# EAGLE design TeraDMX_v1_2 (EAGLE 6.3)
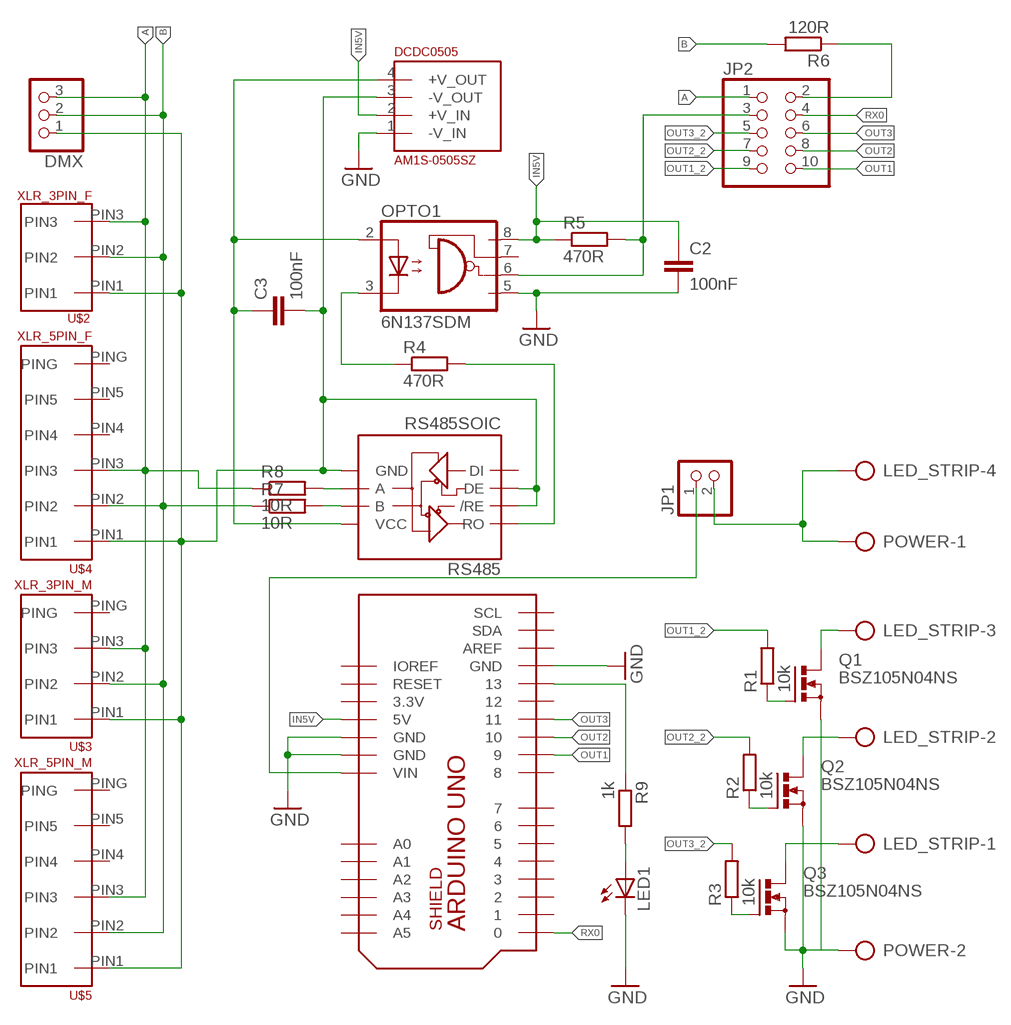
[diagram p0: schematic, sheet 1]

## Parts
C2  100nF  C-EUC0805  [C0805]
C3  100nF  C-EUC0805  [C0805]
DCDC0505  AM1S-0505SZ  [AM1S-0505SZ]
DMX  PINHD-1X3  [1X03]
JP1  PINHD-1X2  [1X02]
JP2  PINHD-2X5  [2X05]
LED1  LEDCHIP-LED0805  [CHIP-LED0805]
LED_STRIP  AK300/4  [AK300/4]
OPTO1  6N137SDM  [6N137SDM]
POWER  AK300/2  [AK300/2]
Q1  BSZ105N04NS  [PG-TDSON-8]
Q2  BSZ105N04NS  [PG-TDSON-8]
Q3  BSZ105N04NS  [PG-TDSON-8]
R1  10k  R-EU_M0805  [M0805]
R2  10k  R-EU_M0805  [M0805]
R3  10k  R-EU_M0805  [M0805]
R4  470R  R-EU_M0805  [M0805]
R5  470R  R-EU_R0805  [R0805]
R6  120R  R-EU_M0805  [M0805]
R7  10R  R-EU_M0805  [M0805]
R8  10R  R-EU_M0805  [M0805]
R9  1k  R-EU_M0805  [M0805]
RS485  RS485SOIC  [SO08]
U$2  XLR_3PIN_F  [XLR_3PIN_F]
U$3  XLR_3PIN_M  [XLR_3PIN_M]
U$4  XLR_5PIN_F  [XLR_5PIN_F]
U$5  XLR_5PIN_M  [XLR_5PIN_M]
U$6  ARDUINO_UNO_SHIELD  [ARDUINO_UNO_SHIELD]

## Nets
A: DMX.3 JP2.1 R8.1 U$2.PIN3 U$3.PIN3 U$4.PIN3 U$5.PIN3
B: DMX.2 R6.2 R7.1 U$2.PIN2 U$3.PIN2 U$4.PIN2 U$5.PIN2
GND: C2.2 DCDC0505.1(-V_IN) LED1.C OPTO1.5(GND) POWER.2 Q1.1(S) Q1.2(S) Q1.3(S) Q2.1(S) Q2.2(S) Q2.3(S) Q3.1(S) Q3.2(S) Q3.3(S) U$6.GND1(GND) U$6.GND2(GND) U$6.GND3(GND)
IN5V: C2.1 DCDC0505.2(+V_IN) OPTO1.8(VCC) R5.1 U$6.5V
N$1: C3.2 DCDC0505.3(-V_OUT) DMX.1 RS485.2(/RE) RS485.3(DE) RS485.5(GND) U$2.PIN1 U$3.PIN1 U$4.PIN1 U$5.PIN1
N$2: C3.1 DCDC0505.4(+V_OUT) OPTO1.2(A) RS485.8(VCC)
N$3: OPTO1.3(C) R4.1
N$5: LED_STRIP.1 Q3.5(D) Q3.6(D) Q3.7(D) Q3.8(D) Q3.TH(D)
N$6: LED_STRIP.2 Q2.5(D) Q2.6(D) Q2.7(D) Q2.8(D) Q2.TH(D)
N$7: LED_STRIP.3 Q1.5(D) Q1.6(D) Q1.7(D) Q1.8(D) Q1.TH(D)
N$8: JP2.2 R6.1
N$9: Q1.4(G) R1.1
N$10: Q2.4(G) R2.1
N$11: Q3.4(G) R3.1
N$12: R4.2 RS485.1(RO)
N$13: JP2.3 OPTO1.6(VO) R5.2
N$16: R7.2 RS485.7(B)
N$17: R8.2 RS485.6(A)
N$22: JP1.1 U$6.VIN
N$24: R9.1 U$6.13
N$25: LED1.A R9.2
OUT1: JP2.10 U$6.9
OUT1_2: JP2.9 R1.2
OUT2: JP2.8 U$6.10
OUT2_2: JP2.7 R2.2
OUT3: JP2.6 U$6.11
OUT3_2: JP2.5 R3.2
PLUS: JP1.2 LED_STRIP.4 POWER.1
RX0: JP2.4 U$6.0
Unconnected: OPTO1.7(VE) RS485.4(DI) U$3.PING U$4.PIN4 U$4.PIN5 U$4.PING U$5.PIN4 U$5.PIN5 U$5.PING U$6.1 U$6.2 U$6.3 U$6.4 U$6.5 U$6.6 U$6.7 U$6.8 U$6.12 U$6.A0 U$6.A1 U$6.A2 U$6.A3 U$6.A4 U$6.A5 U$6.AREF U$6.IOREF U$6.RESET U$6.SCL U$6.SDA

## Power pins joined to a net without a drawn wire
3.3V: U$6.3.3V

## Library data of the parts
C2 C3 = rcl:C-EU: CAPACITOR, European symbol
DCDC0505 = 0_MojaBiblioteka:AM1S-0505SZ
DMX = pinhead:PINHD-1X3: PIN HEADER
JP1 = pinhead:PINHD-1X2: PIN HEADER
JP2 = pinhead:PINHD-2X5: PIN HEADER
LED1 = led:LED: LED OSRAM: - CHIPLED LG R971, LG N971, LY N971, LG Q971, LY Q971, LO R971, LY R971 LH N974, LH R974 LS Q976, LO Q976, LY Q976 LO Q996 - Hyper CHIPLED LW Q18S LB Q993, LB Q99A, LB R99A - SideLED LS A670, LO A670, LY A670, LG A670, LP A670 LB A673, LV A673, LT A673, LW A673 LH A674 LY A675 LS A676, LA A676, LO A676, LY A676, LW A676 LS A679, LY A679, LG A679 - Hyper Micro SIDELED® LS Y876, LA Y876, LO Y876, LY Y876 LT Y87S - SmartLED LW L88C, LW L88S LB L89C, LB L89S, LG L890 LS L89K, LO L89K, LY L89K LS L896, LA L896, LO L896, LY L896 - TOPLED LS T670, LO T670, LY T670, LG T670, LP T670 LSG T670, LSP T670, LSY T670, LOP T670, LYG T670 LG T671, LOG T671, LSG T671 LB T673, LV T673, LT T673, LW T673 LH T674 LS T676, LA T676, LO T676, LY T676, LB T676, LH T676, LSB T676, LW T676 LB T67C, LV T67C, LT T67C, LS T67K, LO T67K, LY T67K, LW E67C LS E67B, LA E67B, LO E67B, LY E67B, LB E67C, LV E67C, LT E67C LW T67C LS T679, LY T679, LG T679 LS T770, LO T770, LY T770, LG T770, LP T770 LB T773, LV T773, LT T773, LW T773 LH T774 LS E675, LA E675, LY E675, LS T675 LS T776, LA T776, LO T776, LY T776, LB T776 LHGB T686 LT T68C, LB T68C - Hyper Mini TOPLED® LB M676 - Mini TOPLED Santana® LG M470 LS M47K, LO M47K, LY M47K Source: http://www.osram.convergy.de LUXEON: - LUMILED® LXK2-PW12-R00, LXK2-PW12-S00, LXK2-PW14-U00, LXK2-PW14-V00 LXK2-PM12-R00, LXK2-PM12-S00, LXK2-PM14-U00 LXK2-PE12-Q00, LXK2-PE12-R00, LXK2-PE12-S00, LXK2-PE14-T00, LXK2-PE14-U00 LXK2-PB12-K00, LXK2-PB12-L00, LXK2-PB12-M00, LXK2-PB14-N00, LXK2-PB14-P00, LXK2-PB14-Q00 LXK2-PR12-L00, LXK2-PR12-M00, LXK2-PR14-Q00, LXK2-PR14-R00 LXK2-PD12-Q00, LXK2-PD12-R00, LXK2-PD12-S00 LXK2-PH12-R00, LXK2-PH12-S00 LXK2-PL12-P00, LXK2-PL12-Q00, LXK2-PL12-R00 Source: www.luxeon.com KINGBRIGHT: KA-3528ASYC Source: www.kingbright.com
LED_STRIP = con-ptr500:AK300/4: CONNECTOR; OC_FARNELL: unknown; OC_NEWARK: unknown
OPTO1 = 0_MojaBiblioteka:6N137SDM: http://www.tme.eu/pl/Document/9e34bdb0dbfb6811f7da938330bd3ec8/6N137M.pdf
POWER = con-ptr500:AK300/2: CONNECTOR; OC_FARNELL: unknown; OC_NEWARK: unknown
Q1-Q3 = 0_MojaBiblioteka:BSZ105N04NS: OptiMOS (TM)3 Power-Transistor N-Channel, Normal level Source : Data sheet <http://www.infineon.com/dgdl/BSZ105N04NSG_rev1.1.pdf?folderId=db3a3043156fd5730115c7d50620107c&fileId=db3a30431689f4420116c485c67f084e>
R1-R9 = rcl:R-EU_: RESISTOR, European symbol
RS485 = SparkFun-DigitalIC:RS485: RS485 transceiver
U$2 = 0_MojaBiblioteka:XLR_3PIN_F: AMPHENOL AC3FAH-AU-PRE Gniazdo; XLR; żeńskie; PIN:3; kątowe 90°; z przyciskiem; THT; 133V http://www.tme.eu/pl/details/ac3fah-au-pre/zlacza-xlr/amphenol/ http://www.tme.eu/pl/Document/09a1d31ba2723210cedbb5dd43d3df77/AC3FAH-AU-PRE.pdf
U$3 = 0_MojaBiblioteka:XLR_3PIN_M: AMPHENOL AC3MAH-AU-PRE Gniazdo; XLR; męskie; PIN:3; kątowe 90°; przykręcane; THT; złocony http://www.tme.eu/pl/details/ac3mah-au-pre/zlacza-xlr/amphenol/ http://www.tme.eu/pl/Document/d88f4fba44421ffb781d4352edeebc64/AC3MAH-AU-PRE.pdf
U$4 = 0_MojaBiblioteka:XLR_5PIN_F: CLIFF 5XNACF/PC90L (CP300405) Gniazdo; XLR; żeńskie; PIN:5; kątowe 90°; z przyciskiem; THT; 5A http://www.tme.eu/pl/details/cp300405/zlacza-xlr/cliff/5xnacfpc90l-cp300405/
U$5 = 0_MojaBiblioteka:XLR_5PIN_M: CLIFF 5XNACM/PC90(CP300255) Gniazdo; XLR; męskie; PIN:5; kątowe 90°; na panel, przykręcane; THT http://www.tme.eu/pl/details/cp300255/zlacza-xlr/cliff/5xnacmpc90cp300255/
U$6 = 0_Xirux:ARDUINO_UNO_SHIELD: Arduino Uno Shield by Robert Mordzon

## Board
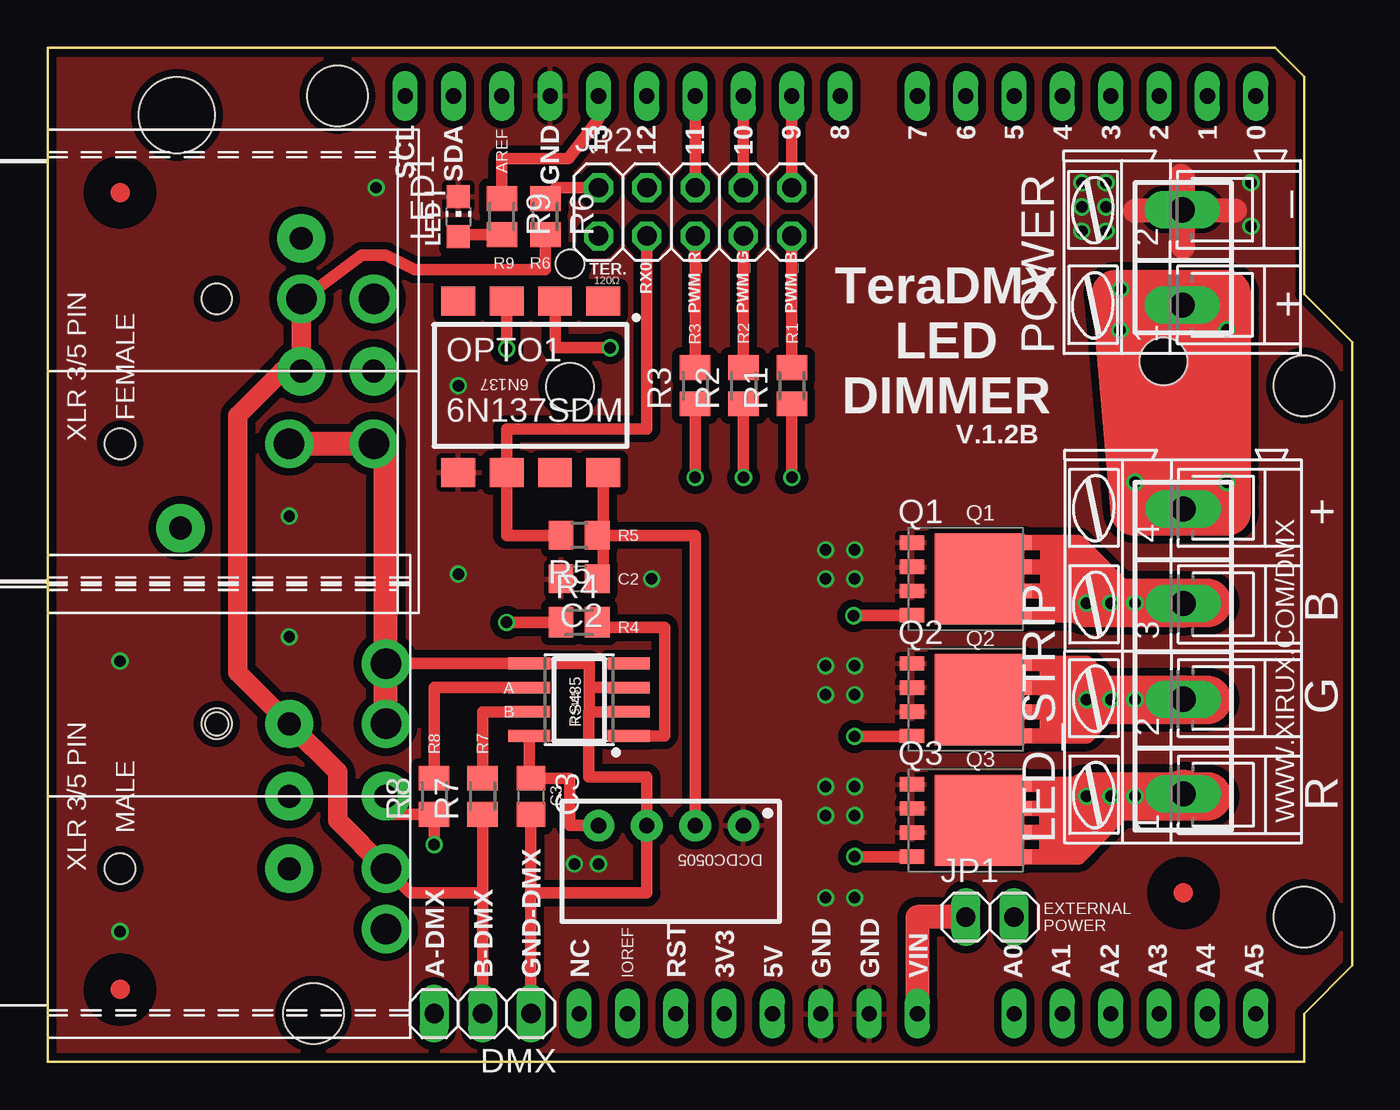
[diagram p1: board, top side]
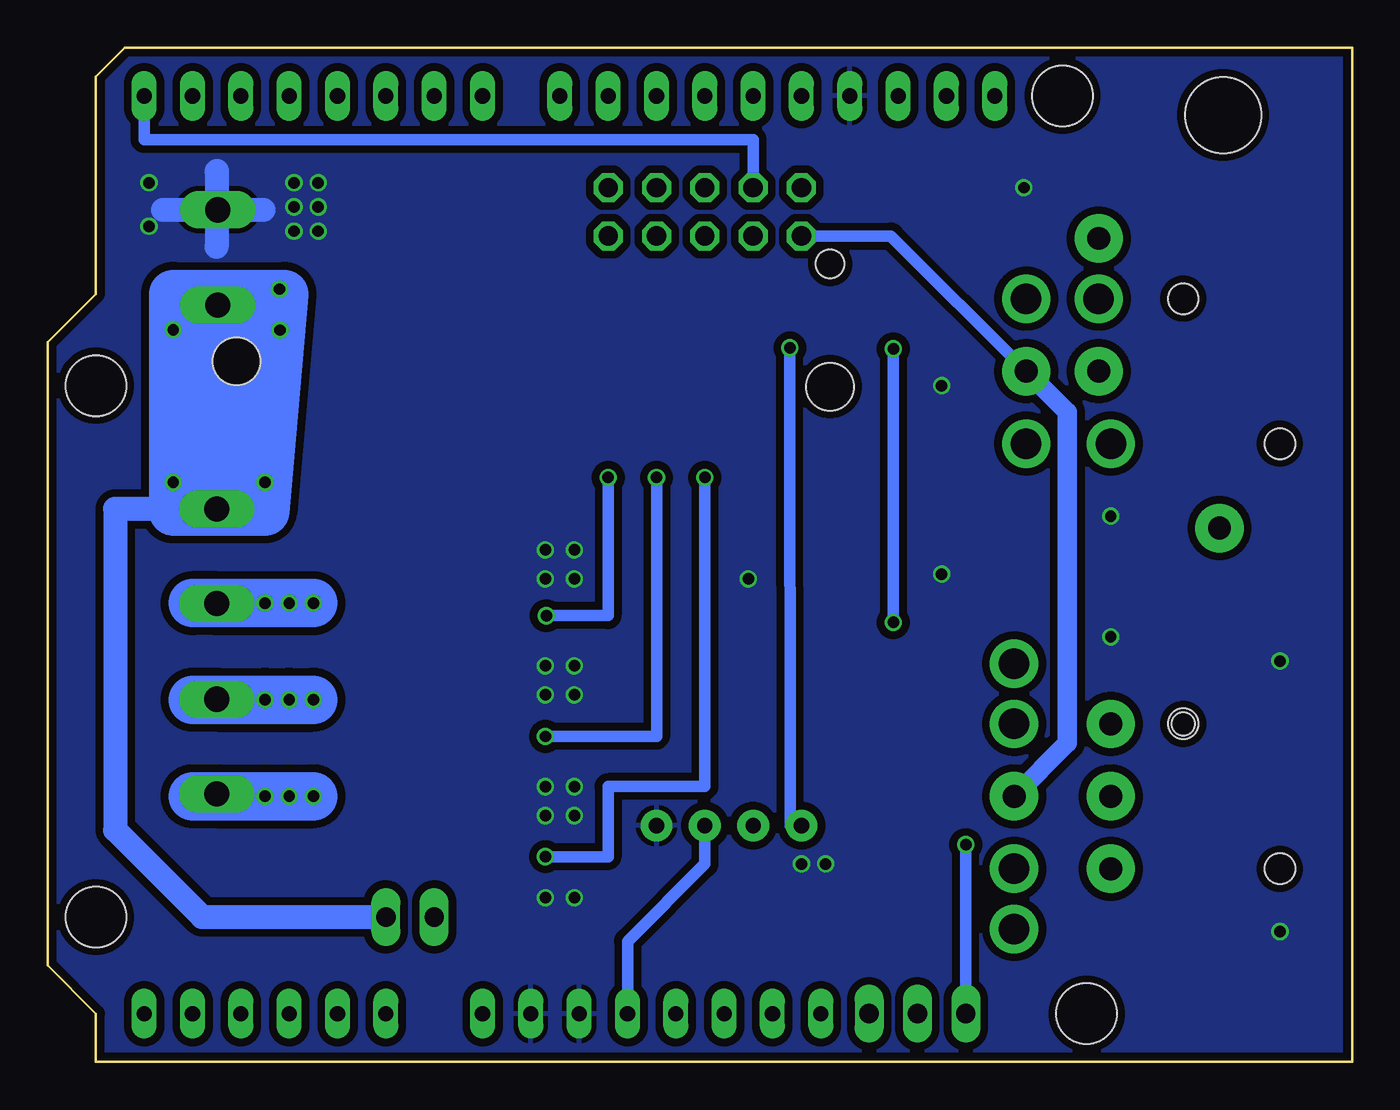
[diagram p2: board, bottom side, seen from below]

Size 68.58 x 53.34 mm. Coordinates in mm from the lower left corner, seen from the top.
Copper layers (1*16): Top 0.035mm / dielectric 1.5mm / Bottom 0.035mm
Design rules "SeeedStudio_2layer_DRU_no_angle_20140221 *": minimum track width 6mil, minimum drill 12mil, track to track 6mil, track to pad 6mil, pad to pad 6mil, via to via 6mil, smd to smd 0mil, copper to edge 10mil, drill to drill 10mil, minimum pad ring 10mil, minimum via ring 6mil, stop-mask expansion 2mil, vias tented up to drill 100mil, thermal gap 10mil
Holes 2.5 mm at 58.65,36.83 27.46,35.51
Holes 1.5 mm at 27.46,41.96
Holes 4 mm at 6.8,49.79

### Footprints (pad centres in the part's own frame; a part is rotated, then mirrored left to right if it is on the bottom)
C0805 = smd 1.3 x 1.5: 1 -0.95,0; 2 0.95,0
AM1S-0505SZ = drill 0.8 pad 1.676: 1 -3.81,-2.54; 2 -1.27,-2.54; 3 1.27,-2.54; 4 3.81,-2.54
1X03 = drill 1.016 long: 1 -2.54,0; 2 0,0; 3 2.54,0
1X02 = drill 1.016 long: 1 -1.27,0; 2 1.27,0
2X05 = drill 1.016 octagon: 1 -5.08,-1.27; 2 -5.08,1.27; 3 -2.54,-1.27; 4 -2.54,1.27; 5 0,-1.27; 6 0,1.27; 7 2.54,-1.27; 8 2.54,1.27; 9 5.08,-1.27; 10 5.08,1.27
CHIP-LED0805 = smd 1.2 x 1.2: A 0,-1.05; C 0,1.05
AK300/4 = drill 1.321 long: 1 -7.493,0; 2 -2.515,0; 3 2.515,0; 4 7.493,0
6N137SDM = smd 1.778 x 1.524: 1 3.81,4.445; 2 1.27,4.445; 3 -1.27,4.445; 4 -3.81,4.445; 5 -3.81,-4.572; 6 -1.27,-4.572; 7 1.27,-4.572; 8 3.81,-4.572
AK300/2 = drill 1.321 long: 1 -2.515,0; 2 2.489,0
PG-TDSON-8 = smd 1.3 x 0.75: 1 -2.825,1.905; 2 -2.825,0.635; 3 -2.825,-0.635; 4 -2.825,-1.905; 5 2.825,-1.905; 6 2.825,-0.635; 7 2.825,0.635; 8 2.825,1.905 | smd 4.7 x 4.8: TH 0.725,0
M0805 = smd 1.3 x 1.6: 1 -0.95,0; 2 0.95,0
R0805 = smd 1.3 x 1.5: 1 -0.95,0; 2 0.95,0
SO08 = smd 0.61 x 2.21: 1 -1.905,-2.616; 2 -0.635,-2.616; 3 0.635,-2.616; 4 1.905,-2.616; 5 1.905,2.616; 6 0.635,2.616; 7 -0.635,2.616; 8 -1.905,2.616
XLR_3PIN_F = drill 1.6 pad 2.54: PIN1 -3.81,-12.7; PIN2 3.81,-13.335 | drill 1.2 pad 2.54: PIN3 0,-17.145 | hole 1.6: -3.81,-3.81; 3.81,-8.89
XLR_3PIN_M = drill 1.6 pad 2.54: PIN1 3.81,-17.78; PIN2 -3.81,-17.78 | drill 1.2 pad 2.54: PIN3 0,-17.78; PING 0,-12.7 | hole 1.6: 3.81,-8.89; -3.81,-3.81
XLR_5PIN_F = drill 1.6 pad 2.54: PIN1 -3.81,-17.145; PIN5 3.81,-17.145 | drill 1.2 pad 2.54: PIN2 0,-13.335; PIN3 0,-17.145; PIN4 6.985,-13.335; PING -8.25,-6.985 | hole 1.6: 3.81,-8.89; -3.81,-3.81
XLR_5PIN_M = drill 1.6 pad 2.54: PIN1 6.98,-17.78; PIN5 -6.98,-17.78 | drill 1.2 pad 2.54: PIN2 3.81,-12.7; PIN3 0,-17.78; PIN4 -3.81,-12.7; PING 0,-12.7 | hole 1.6: -3.81,-3.81 | hole 1.2: 3.81,-8.89
ARDUINO_UNO_SHIELD = drill 0.8 long: 0 63.5,50.8; 1 60.96,50.8; 2 58.42,50.8; 3 55.88,50.8; 3.3V 35.56,2.54; 4 53.34,50.8; 5 50.8,50.8; 5V 38.1,2.54; 6 48.26,50.8; 7 45.72,50.8; 8 41.656,50.8; 9 39.116,50.8; 10 36.576,50.8; 11 34.036,50.8; 12 31.496,50.8; 13 28.956,50.8; A0 50.8,2.54; A1 53.34,2.54; A2 55.88,2.54; A3 58.42,2.54; A4 60.96,2.54; A5 63.5,2.54; AREF 23.876,50.8; GND1 26.416,50.8; GND2 40.64,2.54; GND3 43.18,2.54; IOREF 30.48,2.54; NC 27.94,2.54; RESET 33.02,2.54; SCL 18.796,50.8; SDA 21.336,50.8; VIN 45.72,2.54 | hole 3.175: 15.24,50.8; 13.97,2.54; 66.04,35.56; 66.04,7.62

### Placement (x,y rotation side)
C2  27.94,25.4 180 top
C3  25.4,13.97 270 top
DCDC0505  32.77,9.89 180 top
DMX  22.86,2.54 180 top
JP1  49.53,7.62 0 top
JP2  34.04,44.7 0 top
LED1  21.59,44.45 0 top
LED_STRIP  59.69,21.59 90 top
OPTO1  25.4,35.56 0 top
POWER  59.64,42.32 90 top
Q1  48.26,25.4 0 top
Q2  48.26,19.05 0 top
Q3  48.26,12.7 0 top
R1  39.12,35.56 90 top
R2  36.58,35.56 90 top
R3  34.04,35.56 90 top
R4  27.94,23.11 0 top
R5  27.94,27.69 180 top
R6  26.16,44.45 270 top
R7  22.86,13.97 90 top
R8  20.32,13.97 90 top
R9  23.88,44.45 270 top
RS485  27.94,19.05 90 top
U$1  [CIRCLE-1MM-3R]  3.81,3.81 0 top
U$2  0,36.32 90 top
U$3  0,13.97 90 top
U$4  0,36.32 90 top
U$5  0,13.97 90 top
U$6  0,0 0 top
U$7  [CIRCLE-1MM-3R]  3.81,45.72 0 top
U$8  [CIRCLE-1MM-3R]  59.69,8.89 0 top

### Tracks (layer width: path | path; a pad name or v marks a point on that pad's centre or on a via)
A  (via drill 0.6)
  Top 0.61: U$3.PIN3 17.78,13.02 R8.1 v20.32,11.43
  Bottom 0.61: JP2.1 24.26,43.43 U$2.PIN3 | DMX.3 v20.32,11.43
  Bottom 1.016: U$2.PIN3 14.99,34.16 14.99,16.76 U$3.PIN3
B
  Top 0.61: U$3.PIN2 19.05,8.89 22.86,8.89 | 22.86,8.89 R7.1 | DMX.2 22.86,8.89 | U$2.PIN2 13.46,40.13 16.51,42.42 17.78,42.42 19.3,41.66 26.16,41.66 R6.2
  Top 1.016: U$2.PIN2 U$4.PIN2 12.32,36.32 10,34 10,20.48 U$5.PIN2 15.24,15.24 15.24,12.7 U$3.PIN2
GND  (via drill 0.6)
  Top 1.27: 62.41,44.78 62.31,44.76 57.15,44.76 | 59.56,46.58 59.66,46.51 59.66,42.85
  Bottom 1.27: 62.51,44.81 57.23,44.81 | 59.66,46.86 59.69,46.84 59.69,42.85
  other vias: 27.69,10.41 42.42,26.92 42.42,25.4 40.89,26.92 42.42,20.83 42.42,19.3 40.89,19.3 40.89,20.83 40.89,25.4 42.42,14.48 42.42,12.95 40.89,12.95 40.89,14.48 28.96,10.41 31.75,25.4 21.59,25.65 17.27,45.97 21.59,35.56 54.36,46.23 54.36,44.96 55.63,44.96 55.63,46.23 63.25,46.23 63.25,43.94 3.81,6.86 3.81,21.08 54.36,43.69 55.63,43.69 40.89,8.64 42.42,8.64 12.7,28.7 12.7,22.35
  pour Top (isolate 0.406): 0,53.34 0,0 66.04,0 66.04,2.54 68.58,5.08 68.58,37.85 66.04,40.39 66.04,51.82 64.52,53.34
  pour Bottom (isolate 0.406): 0,53.34 0,0 66.04,0 66.04,2.54 68.58,5.08 68.58,37.85 66.04,40.39 66.04,51.82 64.52,53.34
IN5V
  Top 0.61: DCDC0505.2 34.04,27.69 R5.1 29.21,27.69 | OPTO1.8 29.21,27.69 | C2.1 29.21,25.4 29.21,27.69
  Bottom 0.61: DCDC0505.2 34.04,10.41 38.1,6.35 U$6.5V
N$1
  Top 0.61: 28.46,18.41 RS485.2 | 28.46,18.41 28.46,19.68 | 28.46,19.68 RS485.3 | 28.46,19.68 28.46,20.95 RS485.5 U$5.PIN1 | DMX.1 25.4,8.89 | 25.4,8.89 31.5,8.89 DCDC0505.3 31.5,14.99 28.45,14.99 28.45,18.41 28.46,18.41 | C3.2 25.4,8.89
  Top 1.27: U$2.PIN1 U$4.PIN1 17.78,32.51 U$5.PIN1 U$3.PIN1
N$2  (via drill 0.6)
  Top 0.61: RS485.8 25.32,14.92 C3.1 27.43,14.92 27.43,12.43 DCDC0505.4 | v29.57,37.55 26.67,37.55 OPTO1.2
  Bottom 0.61: DCDC0505.4 29.54,12.42 v29.57,37.55
N$3  (via drill 0.6)
  Top 0.61: OPTO1.3 v24.13,37.5 | v24.13,23.11 R4.1
  Bottom 0.61: v24.13,37.5 v24.13,23.11
N$4  (via drill 0.6)
  Top 2.54: 58.42,39.37 57.15,39.37 v56.36,38.48 v57.15,30.48 57.15,28.96 | 61.98,39.37 v61.98,38.51 v61.98,30.48 61.98,28.96 57.15,28.96 | 61.98,39.37 60.96,39.37 | 59.69,39.37 58.42,39.37 | 58.42,39.37 58.42,29.21 59.69,29.21 | 59.69,29.21 60.96,29.21 60.96,39.37 | 60.96,39.37 59.69,39.37 | 59.69,39.37 59.69,29.21 | 61.98,39.37 61.98,40.39 56.13,40.39 57.15,28.96
  Bottom 2.54: 57.15,28.96 v57.15,30.48 v56.36,38.48 57.15,39.37 60.96,39.37 | v61.98,30.48 61.98,28.96 57.15,28.96 | v61.98,30.48 v61.98,38.51 61.72,36.58 60.96,39.37 | 60.96,39.37 60.96,30.48 59.69,30.48 | 59.69,30.48 58.42,30.48 58.42,38.1 59.69,38.1 59.69,30.48 | v61.98,30.48 61.98,40.39 56.13,40.39 57.15,28.96
N$5  (via drill 0.6)
  Top 0.813: Q3.5 54.2,10.79 57.3,13.97 | Q3.6 53.98,12.06 v55.88,13.97 55.24,14.61 Q3.8 | v54.61,13.97 53.98,13.34 Q3.7 49.62,13.34 Q3.TH
  Top 2.54: LED_STRIP.1 59.69,13.97 | 59.69,13.97 57.3,13.97 v57.15,13.97 v55.88,13.97 v54.61,13.97 | 59.69,13.97 60.96,13.97
  Bottom 2.54: v54.61,13.97 v55.88,13.97 v57.15,13.97 59.69,13.97 60.96,13.97
N$6  (via drill 0.6)
  Top 0.813: 54.61,19.68 Q2.7 48.98,19.68 Q2.TH | 54.61,19.68 v54.61,19.05 54.61,18.41 | Q2.6 54.61,18.41 | Q2.5 54.61,17.14 | 54.61,17.14 54.61,18.41 | Q2.8 54.61,20.95 | 54.61,20.95 54.61,19.68 | 53.34,17.78 53.98,17.78 54.61,17.14 | 54.61,17.14 55.63,18.16 | 53.34,20.32 53.98,20.32 54.61,20.95 | 54.61,20.95 55.65,19.91
  Top 2.54: LED_STRIP.2 59.69,19.05 | 59.69,19.05 v57.15,19.05 v55.88,19.05 v54.61,19.05 | 59.69,19.05 60.96,19.05
  Bottom 2.54: v54.61,19.05 v55.88,19.05 v57.15,19.05 59.69,19.05 60.96,19.05
N$7  (via drill 0.6)
  Top 0.813: Q1.5 53.98,23.5 54.18,23.7 | 54.18,23.7 v54.61,24.13 53.98,24.77 Q1.6 | 54.18,26.04 Q1.7 48.98,26.04 Q1.TH | 54.18,26.04 54.18,23.7 | Q1.8 53.34,27.3 | 54.18,27.3 54.18,26.04 | 53.34,26.67 53.34,27.3 | 53.34,27.3 54.18,27.3 | 54.18,27.3 56.64,24.84 55.93,24.84 54.28,26.49 54.28,26.09 54.03,25.83 54.3,25.83 54.86,25.27
  Top 2.54: LED_STRIP.3 59.69,24.13 | 59.69,24.13 v57.15,24.13 v55.88,24.13 v54.61,24.13 | 59.69,24.13 60.96,24.13
  Bottom 2.54: v54.61,24.13 v55.88,24.13 v57.15,24.13 59.69,24.13 60.96,24.13
N$8
  Top 0.61: JP2.2 26.74,45.97 R6.1
N$9  (via drill 0.6)
  Top 0.61: v39.12,30.73 R1.1 | v42.37,23.47 45.38,23.47 Q1.4
  Bottom 0.61: v39.12,30.73 39.12,23.47 v42.37,23.47
N$10  (via drill 0.6)
  Top 0.61: R2.1 v36.58,30.73 | v42.42,17.12 45.44,17.12 Q2.4
  Bottom 0.61: v36.58,30.73 36.58,17.12 v42.42,17.12
N$11  (via drill 0.6)
  Top 0.61: R3.1 v34.04,30.73 | v42.42,10.79 Q3.4
  Bottom 0.61: v34.04,30.73 34.04,14.48 39.12,14.48 39.12,10.79 v42.42,10.79
N$12
  Top 0.61: R4.2 29.65,22.86 32.44,22.86 32.44,17.14 RS485.1
N$13
  Top 0.61: R5.2 24.13,27.69 OPTO1.6 24.13,33.29 31.5,33.29 JP2.3
N$14  (via drill 0.6)
  other vias: 56.39,40.64
N$15
  Top 0.813: 52.58,27.08 52.58,24.08 54.08,24.08 54.08,26.64 52.88,26.64 52.88,25.48 52.93,25.48 52.93,25.5 53.54,25.5
N$16
  Top 0.61: R7.2 22.86,18.41 RS485.7
N$17
  Top 0.61: RS485.6 20.32,19.68 R8.2
N$18
  Top 0.813: 54.13,20.57 54.13,17.7 52.55,17.7 | 52.55,17.7 52.55,20.68 | 52.55,17.7 52.55,17.17 53.06,17.17 53.06,20.47 53.65,20.47 | 53.65,20.47 53.65,20.5 | 53.65,20.47 53.65,17.48
N$19
  Top 0.813: 52.63,14.58 52.53,14.58 52.53,10.92
N$20
  Top 0.813: 53.16,14.38 53.06,14.38 53.06,11.35 53.9,11.35 53.9,11.4 54.13,11.4 55.47,12.75 53.39,12.75 53.34,12.7
N$22
  Top 1.27: JP1.1 45.72,7.62 U$6.VIN
N$24
  Top 0.61: U$6.13 28.96,49.6 27.37,47.5 23.88,47.5 R9.1
N$25
  Top 0.61: R9.2 21.69,43.5 LED1.A
OUT1
  Top 0.61: U$6.9 JP2.10
OUT1_2
  Top 0.61: JP2.9 R1.2
OUT2
  Top 0.61: U$6.10 JP2.8
OUT2_2
  Top 0.61: JP2.7 R2.2
OUT3
  Top 0.61: U$6.11 JP2.6
OUT3_2
  Top 0.61: JP2.5 R3.2
PLUS
  Top 2.54: POWER.1 LED_STRIP.4
  Bottom 1.27: LED_STRIP.4 65.02,29.08 65.02,12.19 60.45,7.62 JP1.2
RX0
  Bottom 0.61: JP2.4 31.5,48.51 63.5,48.51 U$6.0

### Text on the board
tSilk: AREF | SCL / SDA / / GND / 13 / 12 / 11 / 10 / 9 / 8 | 7 / 6 / 5 / 4 / 3 / 2 / 1 / 0 | _ | LED | | R9 | R6 | TER. | 120Ω | RX0 | PWM_R | PWM_G | PWM_B | + | R3 | R2 | R1 | XLR 3/5 PIN / FEMALE | 6N137 | V.1.2B | R5 | Q1 | + | C2 | TeraDMX / LED / DIMMER | R4 | B | Q2 | WWW.XIRUX.COM/DMX | A | B | RS485 | G | R8 | R7 | Q3 | XLR 3/5 PIN / MALE | C3 | R | DCDC0505 | EXTERNAL / POWER | IOREF | A-DMX / B-DMX / GND-DMX / NC / / RST / 3V3 / 5V / GND / GND / VIN | A0 / A1 / A2 / A3 / A4 / A5